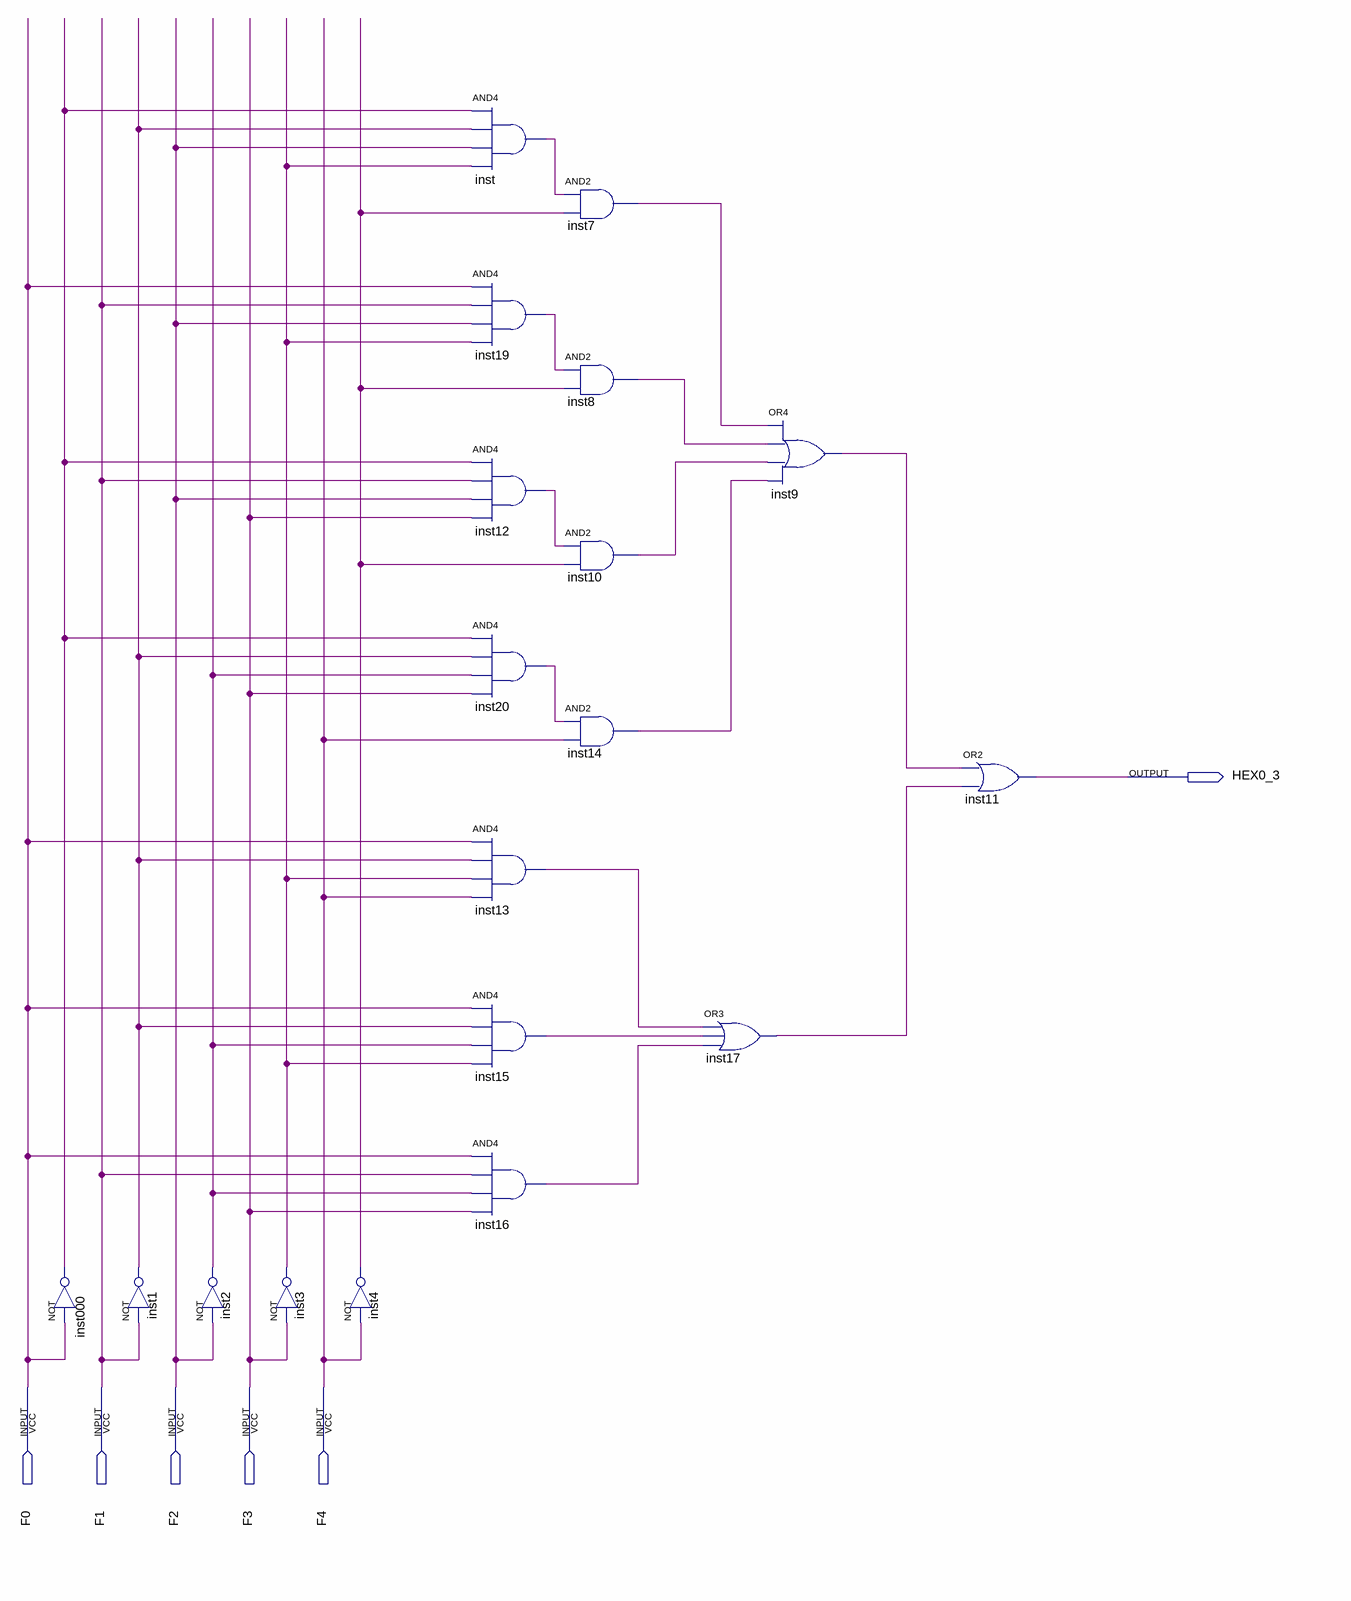
[diagram p0: schematic sheet]
// Quartus schematic HEX03.bdf as structural Verilog: 19 symbols, 6 pins
module HEX03 (
  input  F0,
  input  F1,
  input  F2,
  input  F3,
  input  F4,
  output HEX0_3
);

  wire inst000_out, inst1_out, inst2_out, inst3_out, inst4_out, inst7_out, inst8_out, inst9_out, inst10_out,
       inst12_out, inst13_out, inst14_out, inst15_out, inst16_out, inst17_out, inst19_out, inst20_out,
       inst_out;

  not inst000 (inst000_out, F0);
  not inst1 (inst1_out, F1);
  not inst2 (inst2_out, F2);
  not inst3 (inst3_out, F3);
  not inst4 (inst4_out, F4);
  and inst (inst_out, inst000_out, inst1_out, F2, inst3_out);
  and inst19 (inst19_out, F0, F1, F2, inst3_out);
  and inst12 (inst12_out, inst000_out, F1, F2, F3);
  and inst20 (inst20_out, inst000_out, inst1_out, inst2_out, F3);
  and inst13 (inst13_out, F0, inst1_out, inst3_out, F4);
  and inst15 (inst15_out, F0, inst1_out, inst2_out, inst3_out);
  and inst16 (inst16_out, F0, F1, inst2_out, F3);
  and inst7 (inst7_out, inst_out, inst4_out);
  and inst8 (inst8_out, inst19_out, inst4_out);
  and inst10 (inst10_out, inst12_out, inst4_out);
  and inst14 (inst14_out, inst20_out, F4);
  or inst17 (inst17_out, inst13_out, inst15_out, inst16_out);
  or inst9 (inst9_out, inst7_out, inst8_out, inst10_out, inst14_out);
  or inst11 (HEX0_3, inst9_out, inst17_out);
endmodule
